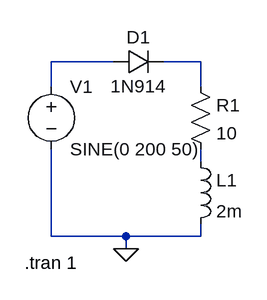
[diagram p0: schematic HWR.asc]
HWR.asc, the LTspice schematic file:
Version 4
SHEET 1 880 680
WIRE 240 48 160 48
WIRE 352 48 304 48
WIRE 160 80 160 48
WIRE 352 80 352 48
WIRE 352 176 352 160
WIRE 160 272 160 160
WIRE 256 272 160 272
WIRE 352 272 352 256
WIRE 352 272 256 272
WIRE 256 288 256 272
FLAG 256 288 0
SYMBOL voltage 160 64 R0
WINDOW 123 24 114 Left 2
WINDOW 39 0 0 Left 0
SYMATTR InstName V1
SYMATTR Value SINE(0 200 50)
SYMBOL diode 240 64 R270
WINDOW 0 32 32 VTop 2
WINDOW 3 0 32 VBottom 2
SYMATTR InstName D1
SYMATTR Value 1N914
SYMBOL res 336 64 R0
SYMATTR InstName R1
SYMATTR Value 10
SYMBOL ind 336 160 R0
SYMATTR InstName L1
SYMATTR Value 2m
TEXT 126 306 Left 2 !.tran 1

The netlist it stands for:
* HWR.asc
V1 N001 0 SINE(0 200 50)
D1 N001 N002 1N914
R1 N002 N003 10
L1 N003 0 2m
.model D D
.lib standard.dio
.tran 1
.backanno
.end